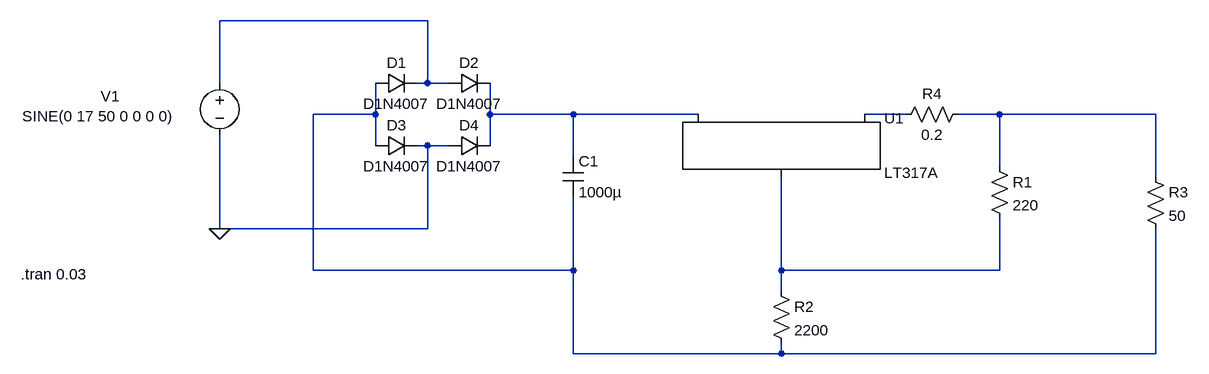
[diagram p0: schematic Draft6.asc]
Draft6.asc, the LTspice schematic file:
Version 4
SHEET 1 1448 680
WIRE 240 16 -80 16
WIRE -80 112 -80 16
WIRE 240 112 240 16
WIRE 240 112 224 112
WIRE 272 112 240 112
WIRE 160 160 160 112
WIRE 160 160 64 160
WIRE 336 160 336 112
WIRE 464 160 336 160
WIRE 656 160 464 160
WIRE 976 160 912 160
WIRE 1120 160 1056 160
WIRE 1360 160 1120 160
WIRE 160 208 160 160
WIRE 240 208 224 208
WIRE 272 208 240 208
WIRE 336 208 336 160
WIRE 464 224 464 160
WIRE 1120 240 1120 160
WIRE 1360 256 1360 160
WIRE -80 336 -80 192
WIRE 240 336 240 208
WIRE 240 336 -80 336
WIRE 64 400 64 160
WIRE 464 400 464 288
WIRE 464 400 64 400
WIRE 784 400 784 256
WIRE 1120 400 1120 320
WIRE 1120 400 784 400
WIRE 784 432 784 400
WIRE 464 528 464 400
WIRE 784 528 784 512
WIRE 784 528 464 528
WIRE 1360 528 1360 336
WIRE 1360 528 784 528
FLAG -80 336 0
SYMBOL voltage -80 96 R0
WINDOW 0 -183 36 Left 2
WINDOW 3 -304 67 Left 2
WINDOW 123 0 0 Left 0
WINDOW 39 0 0 Left 0
SYMATTR InstName V1
SYMATTR Value SINE(0 17 50 0 0 0 0)
SYMBOL diode 160 128 R270
WINDOW 0 32 32 VTop 2
WINDOW 3 0 32 VBottom 2
SYMATTR InstName D1
SYMATTR Value D1N4007
SYMBOL diode 272 128 R270
WINDOW 0 32 32 VTop 2
WINDOW 3 0 32 VBottom 2
SYMATTR InstName D2
SYMATTR Value D1N4007
SYMBOL diode 160 224 R270
WINDOW 0 32 32 VTop 2
WINDOW 3 0 32 VBottom 2
SYMATTR InstName D3
SYMATTR Value D1N4007
SYMBOL diode 272 224 R270
WINDOW 0 32 32 VTop 2
WINDOW 3 0 32 VBottom 2
SYMATTR InstName D4
SYMATTR Value D1N4007
SYMBOL cap 448 224 R0
SYMATTR InstName C1
SYMATTR Value 1000µ
SYMBOL PowerProducts\\LT317A 784 160 R0
SYMATTR InstName U1
SYMBOL res 1104 224 R0
SYMATTR InstName R1
SYMATTR Value 220
SYMBOL res 768 416 R0
SYMATTR InstName R2
SYMATTR Value 2200
SYMBOL res 1344 240 R0
SYMATTR InstName R3
SYMATTR Value 50
SYMBOL res 1072 144 R90
WINDOW 0 0 56 VBottom 2
WINDOW 3 32 56 VTop 2
SYMATTR InstName R4
SYMATTR Value 0.2
TEXT -386 406 Left 2 !.tran 0.03

The netlist it stands for:
* Draft6.asc
V1 N001 0 SINE(0 17 50 0 0 0 0)
D1 N002 N001 D1N4007
D2 N001 N003 D1N4007
D3 N002 0 D1N4007
D4 0 N003 D1N4007
C1 N003 N002 1000µ
XU1 N006 N004 N003 LT317A
R1 N005 N006 220
R2 N006 N002 2200
R3 N005 N002 50
R4 N005 N004 0.2
.model D D
.lib standard.dio
.tran 0.03
.lib LTC.lib
.backanno
.end